# Altium project weihnachten.PrjPcb
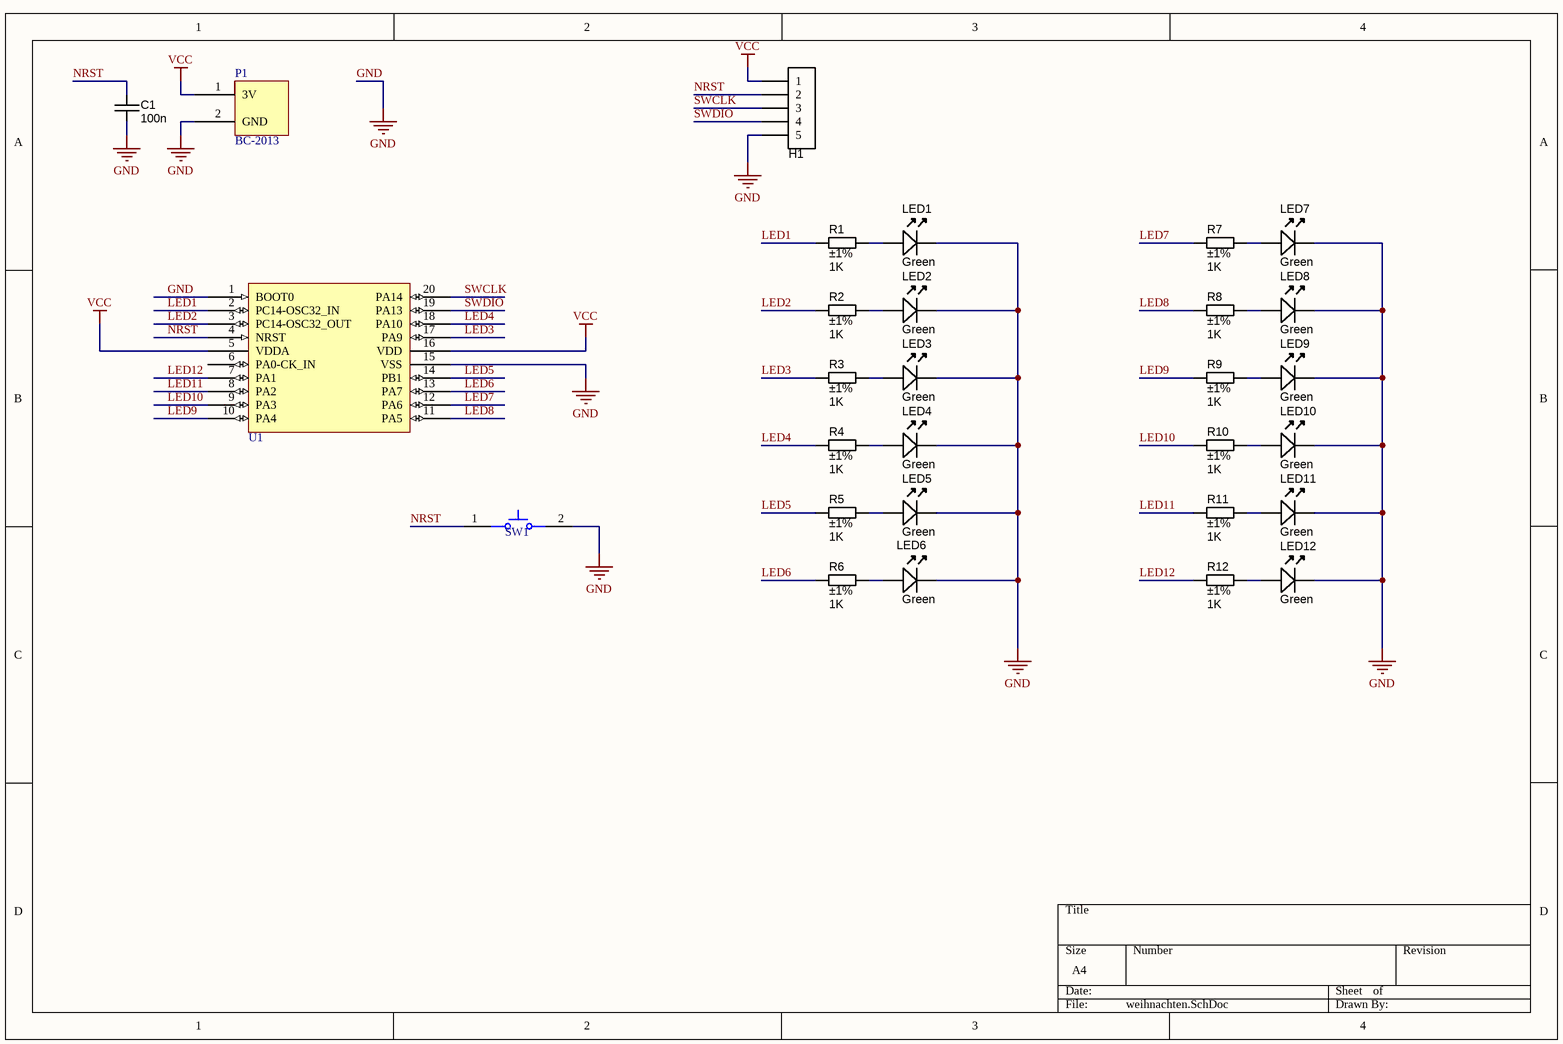
[diagram p0: weihnachten.SchDoc]
1 sheet, 29 parts. Net scope: global (net labels, ports and power ports of the same name join across sheets).
Board file: weihnachten.PcbDoc

## Sheet weihnachten.SchDoc
size A4

### Parts
C1  value 100n  [CAPC1608X90N]  (hidden comment: CAPC_2u2_0603_10V_10%)
H1  Programmer  [HDR1X5_2.54MMP]  (value not drawn)  (no BOM)
LED1  Green  [LED-0603-GREEN]
LED2  Green  [LED-0603-GREEN]
LED3  Green  [LED-0603-GREEN]
LED4  Green  [LED-0603-GREEN]
LED5  Green  [LED-0603-GREEN]
LED6  Green  [LED-0603-GREEN]
LED7  Green  [LED-0603-GREEN]
LED8  Green  [LED-0603-GREEN]
LED9  Green  [LED-0603-GREEN]
LED10  Green  [LED-0603-GREEN]
LED11  Green  [LED-0603-GREEN]
LED12  Green  [LED-0603-GREEN]
P1  BC-2013  [BC-2013-ND]
R1  value 1K  Tolerance: ±1%  [RESC1608X55N]  (hidden comment: Thick Film)
R2  value 1K  Tolerance: ±1%  [RESC1608X55N]  (hidden comment: Thick Film)
R3  value 1K  Tolerance: ±1%  [RESC1608X55N]  (hidden comment: Thick Film)
R4  value 1K  Tolerance: ±1%  [RESC1608X55N]  (hidden comment: Thick Film)
R5  value 1K  Tolerance: ±1%  [RESC1608X55N]  (hidden comment: Thick Film)
R6  value 1K  Tolerance: ±1%  [RESC1608X55N]  (hidden comment: Thick Film)
R7  value 1K  Tolerance: ±1%  [RESC1608X55N]  (hidden comment: Thick Film)
R8  value 1K  Tolerance: ±1%  [RESC1608X55N]  (hidden comment: Thick Film)
R9  value 1K  Tolerance: ±1%  [RESC1608X55N]  (hidden comment: Thick Film)
R10  value 1K  Tolerance: ±1%  [RESC1608X55N]  (hidden comment: Thick Film)
R11  value 1K  Tolerance: ±1%  [RESC1608X55N]  (hidden comment: Thick Film)
R12  value 1K  Tolerance: ±1%  [RESC1608X55N]  (hidden comment: Thick Film)
SW1  B3U-1000P  [OMRON-B3U-1000_V]  (value not drawn)
U1  STM32L031F6  [STM32L031F6]  (value not drawn)

### Nets
GND: C1.1 H1.5 LED1.K LED2.K LED3.K LED4.K LED5.K LED6.K LED7.K LED8.K LED9.K LED10.K LED11.K LED12.K P1.2(GND) SW1.2 U1.1(BOOT0) U1.15(VSS)
VCC: H1.1 P1.1(3V) U1.5(VDDA) U1.16(VDD)
LED1: R1.1 U1.2(PC14-OSC32_IN)
LED2: R2.1 U1.3(PC14-OSC32_OUT)
LED3: R3.1 U1.17(PA9)
LED4: R4.1 U1.18(PA10)
LED5: R5.1 U1.14(PB1)
LED6: R6.1 U1.13(PA7)
LED7: R7.1 U1.12(PA6)
LED8: R8.1 U1.11(PA5)
LED9: R9.1 U1.10(PA4)
LED10: R10.1 U1.9(PA3)
LED11: R11.1 U1.8(PA2)
LED12: R12.1 U1.7(PA1)
NRST: C1.2 H1.2 SW1.1 U1.4(NRST)
SWCLK: H1.3 U1.20(PA14)
SWDIO: H1.4 U1.19(PA13)
NetLED1_A: LED1.A R1.2
NetLED2_A: LED2.A R2.2
NetLED3_A: LED3.A R3.2
NetLED4_A: LED4.A R4.2
NetLED5_A: LED5.A R5.2
NetLED6_A: LED6.A R6.2
NetLED7_A: LED7.A R7.2
NetLED8_A: LED8.A R8.2
NetLED9_A: LED9.A R9.2
NetLED10_A: LED10.A R10.2
NetLED11_A: LED11.A R11.2
NetLED12_A: LED12.A R12.2

Not connected (* = marked no-connect by the designer): U1 6(PA0-CK_IN)

### Library data of the parts
C1 = CAPC_2u2_0603_10V_10%: Capacitor SMD Cer 2.2uF 10% 10V X5R 0603; Manufacturer 1: AVX Corporation; Manufacturer Part Number 1: 0603ZD225KAT2A; Ratings: 10V; X5R; Material: ceramic; SCDType: spec; Package / Case: 0603 (1608 metric); Tolerance: ±10%; Supplier 1: Digi-Key; Supplier Part Number 1: 478-6212-1-ND; ComponentLink1URL: http://www.avx.com/docs/Catalogs/cx5r.pdf; ComponentLink1Description: http://www.avx.com/docs/Catalogs/cx5r.pdf
H1 = Header5P: Header 5-pin
LED1-LED12 = LED_SMD_Green_0603_570nm: LED 0603 SMD Green 570nm 50mcd 20mA; Manufacturer 1: Kingbright Company LLC; Manufacturer Part Number 1: APT1608CGCK; Material: AlGaInP; Ratings: 20mcd min; 50 mcd typ; 570 nm; Voltage - Forward (Vf) Typ: 2.1V; Viewing Angle: 120°; Lens Style/Size: Rectangle with Flat Top, 1.1mm x 0.8mm; Voltage - Forward (Vf) @ 10mA: 2.0V; SCDType: source; Wavelength - Peak: 574nm; Lens Type: Clear; Package / Case: 0603 (1608 metric); Color: Green; Current - Test: 20mA; Supplier 1: Digi-Key; Supplier Part Number 1: 754-1116-1-ND; RoHS 1: RoHS Compliant; Wavelength - Dominant: 570nm; ComponentLink1URL: http://www.us.kingbright.com/images/catalog/SPEC/APT1608CGCK.pdf; ComponentLink1Description: http://www.us.kingbright.com/images/catalog/SPEC/APT1608CGCK.pdf
R1-R12 = RES_1K_0603_1%: Resistor SMD chip 1k Ohm 0.1W 1% 0603; Manufacturer 1: Yageo; Manufacturer Part Number 1: RC0603FR-071KL; Ratings: 1/10W; SCDType: spec; Package / Case: 0603 (1608 Metric); Supplier 1: Digi-Key; Supplier Part Number 1: 311-1.00KHRCT-ND
SW1 = CMP-2100-03586-1: Ultra-Small Tactile Switch, 0.05 A, 12 V, -25 to 70 degC, 2-Pin SMD, RoHS, Tape and Reel; Manufacturer: Omron Electronic Components; Operating Force: 1.5N; Current Rating: 50mA; Voltage Rating (DC): 12V; Electrical Life: 200000Cycles; Actuator Length: 0.4mm; Insulation Resistance: 100MOhm; Switch Travel: 0.15mm; Throw Configuration: SPST; Illumination Type: Illuminated; Width: 3mm; Weight: 0.022g; Datasheet Version: 42005.0; Datasheet URL: http://www.omron.com/ecb/products/pdf/en-b3u.pdf; Height: 1.2mm; Package Quantity: 1; REACH SVHC: Unknown; Contact Current Rating: 50mA; Contact Material: Silver; Max Current Rating: 50mA; Package Reference: B3U-1000; Termination: SMD/SMT; Packaging: TapeandReel; Manufacturer URL: http://www.omron.com/; RoHSCompliant: true; Mount: SurfaceMount; Length: 4mm; Min Operating Temperature: -25degC; Depth: 2.5mm; Lead Free: LeadFree; Case/Package: SMD/SMT; Package Description: 2-Pin Surface Mount Device, Body 3 x 2.5 mm; Max Operating Temperature: 70degC; Orientation: Straight; Supplier 1: Digi-Key; Supplier Part Number 1: SW1020DKR-ND